# EAGLE design esp5V (EAGLE 7.1.0)
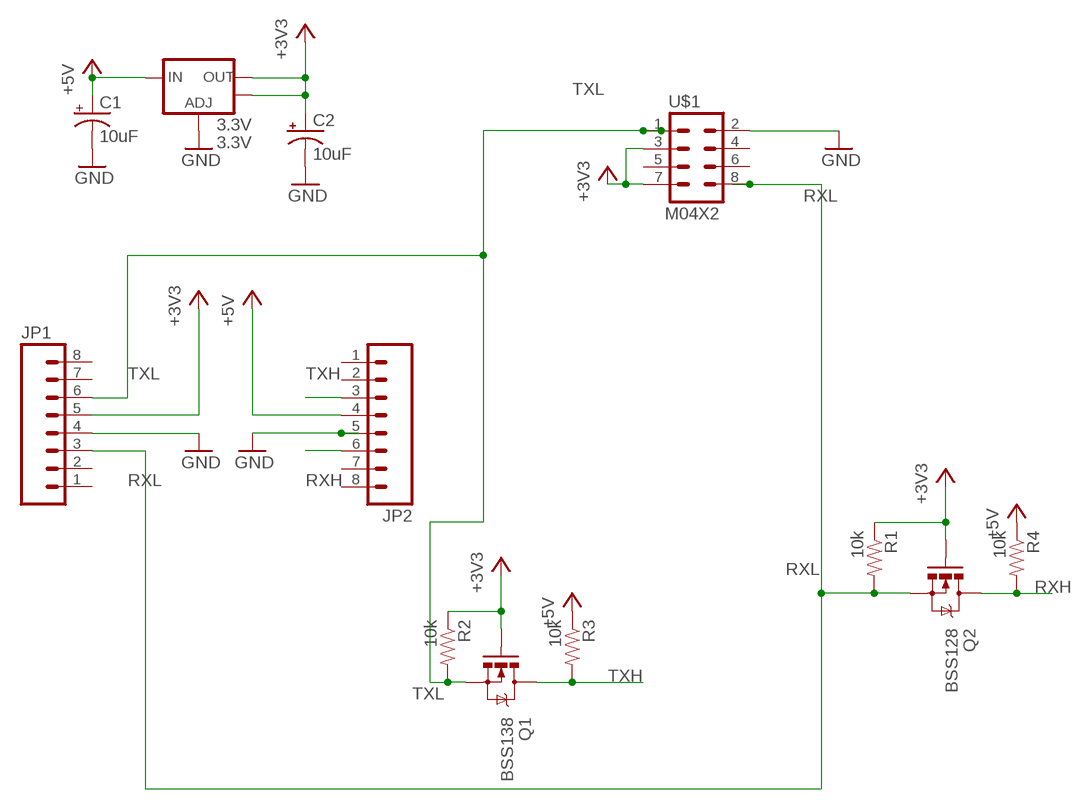
[diagram p0: schematic, sheet 1]

## Parts
3.3V  3.3V  V_REG_LM1117SOT223  [SOT223]
C1  10uF  10UF-16V-10%(TANT)  [EIA3216]
C2  10uF  10UF-16V-10%(TANT)  [EIA3216]
JP1  M08NO_SILK  [1X08_NO_SILK]
JP2  M08NO_SILK  [1X08_NO_SILK]
Q1  BSS138  MOSFET-NCHANNELBSS138  [SOT23-3]
Q2  BSS128  MOSFET-NCHANNELBSS138  [SOT23-3]
R1  10k  0.22OHM1/4W1%(0805)  [0805]
R2  10k  0.22OHM1/4W1%(0805)  [0805]
R3  10k  0.22OHM1/4W1%(0805)  [0805]
R4  10k  0.22OHM1/4W1%(0805)  [0805]
U$1  M04X2  [2X4]

## Nets
+3V3: 3.3V.2(OUT) 3.3V.4(OUT) C2.A(+) JP1.5 Q1.1(G) Q2.1(G) R1.1 R2.1 U$1.3 U$1.7
+5V: 3.3V.3(IN) C1.A(+) JP2.4 R3.1 R4.1
GND: 3.3V.1(ADJ) C1.C(-) C2.C(-) JP1.4 JP2.5 U$1.2
RXH: JP2.6 Q2.3(D) R4.2
RXL: JP1.3 Q2.2(S) R1.2 U$1.8
TXH: JP2.3 Q1.3(D) R3.2
TXL: JP1.6 Q1.2(S) R2.2 U$1.1
Unconnected: JP1.1 JP1.2 JP1.7 JP1.8 JP2.1 JP2.2 JP2.7 JP2.8 U$1.4 U$1.5 U$1.6

## Library data of the parts
3.3V = SparkFun-PowerIC:V_REG_LM1117: Voltage Regulator LM1117 Standard adjustable voltage regulator but in SMD form. Spark Fun Electronics SKU : COM-00595
C1 C2 = SparkFun-Capacitors:10UF-16V-10%(TANT): CAP-00811 1206/EIA-3216 Tantalum capacitor; PROD_ID: CAP-00811
JP1 JP2 = SparkFun-Connectors:M08: Header 8 Standard 8-pin 0.1" header. Use with straight break away headers (SKU : PRT-00116), right angle break away headers (PRT-00553), swiss pins (PRT-00743), machine pins (PRT-00117), and female headers (PRT-00115).
Q1 Q2 = SparkFun-DiscreteSemi:MOSFET-NCHANNEL: Common NMOSFET Parts MFG P/N Store ID Prod ID FDD8780 TRANS-09984 SI7820DN TRANS-11055 FDS6630A IC-08089 2N7002PW TRANS-11151 FQP30N06L COM-10213 TRANS-10060 BSS123LT1G TRANS-08345 BSS138 TRANS-00830 BS170 2N7000; PROD_ID: TRANS-00830
R1-R4 = SparkFun-Resistors:0.22OHM1/4W1%(0805): RES-09883; PROD_ID: RES-09883; VALUE: 0.22
U$1 = SparkFun-Connectors:M04X2: .1" header, two rows of four.

## Board
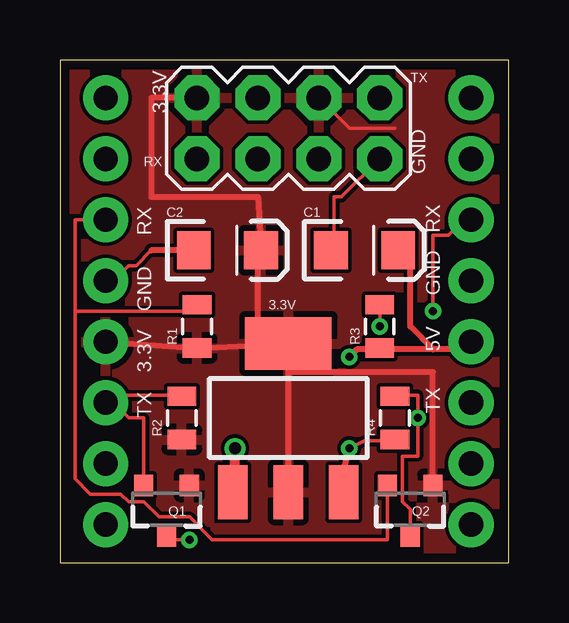
[diagram p1: board, top side]
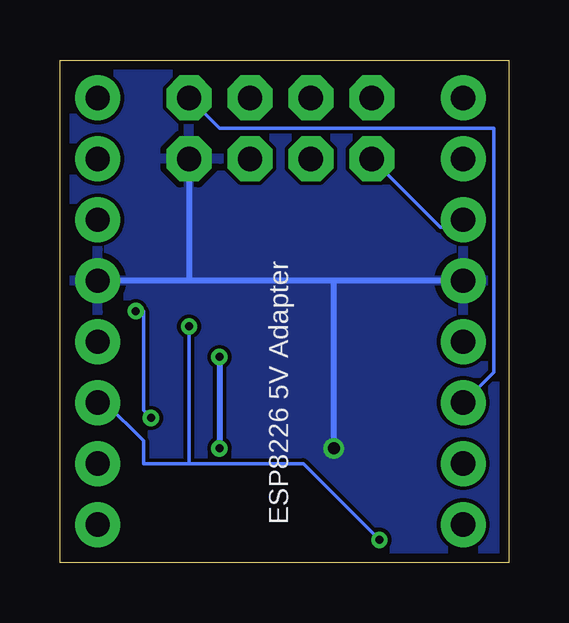
[diagram p2: board, bottom side, seen from below]

Size 18.72 x 20.95 mm. Coordinates in mm from the lower left corner, seen from the top.
Outline: 0,0 18.72,0 18.72,20.95 0,20.95 0,0
Copper layers (1*16): Top 0.0356mm / dielectric 1.5011mm / Bottom 0.0356mm
Design rules "LaenPCBOrder": minimum track width 6mil, minimum drill 13mil, track to track 6mil, track to pad 6mil, pad to pad 6mil, via to via 6mil, smd to smd 6mil, copper to edge 15mil, drill to drill 6mil, minimum pad ring 7mil, minimum via ring 7mil, stop-mask expansion 3mil, vias tented up to drill 0mil, thermal gap 10mil

### Footprints (pad centres in the part's own frame; a part is rotated, then mirrored left to right if it is on the bottom)
SOT223 = smd 1.219 x 2.235: 1 -2.311,-3.099; 2 0,-3.099; 3 2.311,-3.099 | smd 3.6 x 2.2: 4 0,3.099
EIA3216 = smd 1.4 x 1.6: A 1.4,0; C -1.4,0
1X08_NO_SILK = drill 1.016 pad 1.88: 1 0,0; 2 2.54,0; 3 5.08,0; 4 7.62,0; 5 10.16,0; 6 12.7,0; 7 15.24,0; 8 17.78,0
SOT23-3 = smd 0.8 x 0.9: 1 -0.95,-1; 2 0.95,-1; 3 0,1.1
0805 = smd 0.8 x 1.2: 1 -0.9,0; 2 0.9,0
2X4 = drill 1.016 pad 1.88 octagon: 1 -3.81,-1.27; 2 -3.81,1.27; 3 -1.27,-1.27; 4 -1.27,1.27; 5 1.27,-1.27; 6 1.27,1.27; 7 3.81,-1.27; 8 3.81,1.27

### Placement (x,y rotation side)
3.3V  9.53,6.03 0 top
C1  12.7,13.02 0 top
C2  6.99,13.02 0 top
JP1  1.91,19.37 270 top
JP2  17.14,1.59 90 top
Q1  4.45,2.22 180 top
Q2  14.61,2.22 180 top
R1  5.71,9.84 90 top
R2  5.08,6.03 90 top
R3  13.34,9.84 90 top
R4  13.97,6.03 90 top
U$1  9.53,18.1 180 top

### Tracks (layer width: path | path; a pad name or v marks a point on that pad's centre or on a via)
+3V3
  Top 0.152: U$1.3 12.06,18.1 13.97,18.1
  Top 0.254: Q2.1 15.56,7.94 9.53,7.94 3.3V.4 | 3.3V.2 3.3V.4 | 8.23,9.07 R1.1 JP1.5 | 8.23,9.07 3.3V.4 | U$1.7 3.81,19.37 3.81,15.24 8.26,15.24 C2.A 8.23,12.86 8.23,9.07
  pour Top: -0.64,21.59 20,21.91 20,-0.32 -2.22,-1.27
+5V  (via drill 0.33)
  Top 0.152: v12.06,4.76 12.7,5.08 13.97,5.08 R4.1 | 11.75,3.49 11.75,3.17 3.3V.3 | JP2.4 16.83,8.89 | 14.61,12.7 C1.A | 13.34,8.89 R3.1
  Top 0.254: 11.75,3.49 v12.06,4.76 | 16.83,8.89 15.56,8.89 | 15.56,8.89 13.34,8.89 12.38,8.89 v12.06,8.57 | 14.61,12.7 14.61,9.84 15.56,8.89
  Bottom 0.152: 12.06,5.08 v12.06,4.76
  Bottom 0.254: v12.06,8.57 12.06,5.08
GND  (via drill 0.5)
  Top 0.152: U$1.2 11.75,15.24 11.43,15.24 11.43,13.02 C1.C | 3.81,13.02 3.17,12.38 2.86,12.38 2.22,11.75 JP1.4
  Top 0.254: C2.C 3.81,13.02 | 3.3V.1 7.3,3.02
  Top 0.406: 7.3,3.02 v7.3,4.76
  Bottom 0.254: v7.3,4.76 7.3,11.75 | JP1.4 13.34,11.75 | 13.34,11.75 JP2.5 | U$1.2 13.34,11.75
  pour Bottom: -1.91,22.23 21.59,22.23 21.91,-0.95 -1.27,-0.64 -1.27,0.64
RXH  (via drill 0.33)
  Top 0.152: Q2.3 14.61,2.22 14.29,2.54 14.29,4.45 14.92,4.45 v14.92,6.03 14.92,6.99 13.97,6.99 R4.2 | v15.56,10.48 15.56,13.65 16.19,13.65 16.83,14.29 JP2.6
  Bottom 0.152: v14.92,6.03 15.24,6.35 15.24,10.48 v15.56,10.48
RXL
  Top 0.152: 0.64,10.48 0.64,14.29 JP1.3 | 0.64,10.48 0.64,3.49 1.27,2.86 2.54,2.86 2.86,2.54 3.49,2.54 4.13,1.91 5.4,1.91 6.35,0.95 13.65,0.95 13.65,3.17 Q2.2 | 0.64,10.48 5.71,10.48 R1.2
  Bottom 0.152: U$1.8 2.86,13.97 1.91,13.97 JP1.3
TXH  (via drill 0.33)
  Top 0.152: v5.4,0.95 4.45,0.95 Q1.3 | v13.34,9.84 R3.2
  Bottom 0.152: v5.4,0.95 8.57,4.13 13.34,4.13 | 13.34,4.13 15.24,4.13 15.24,5.08 16.83,6.67 JP2.3 | 13.34,4.13 v13.34,9.84
TXL
  Top 0.152: 2.22,6.67 2.86,6.03 3.49,6.03 3.49,3.49 Q1.2 | 2.22,6.67 2.54,6.99 5.08,6.99 R2.2 | 2.22,6.67 JP1.6
  Bottom 0.152: U$1.1 12.06,18.1 0.64,18.1 0.64,7.94 JP1.6

### Text on the board
tNames: TX | 3.3V | RX | GND | RX | RX | GND | GND | 5V | 3.3V | TX | TX
bNames: ESP8226 5V Adapter